# EAGLE design APRSTracker (EAGLE 7.6.0)
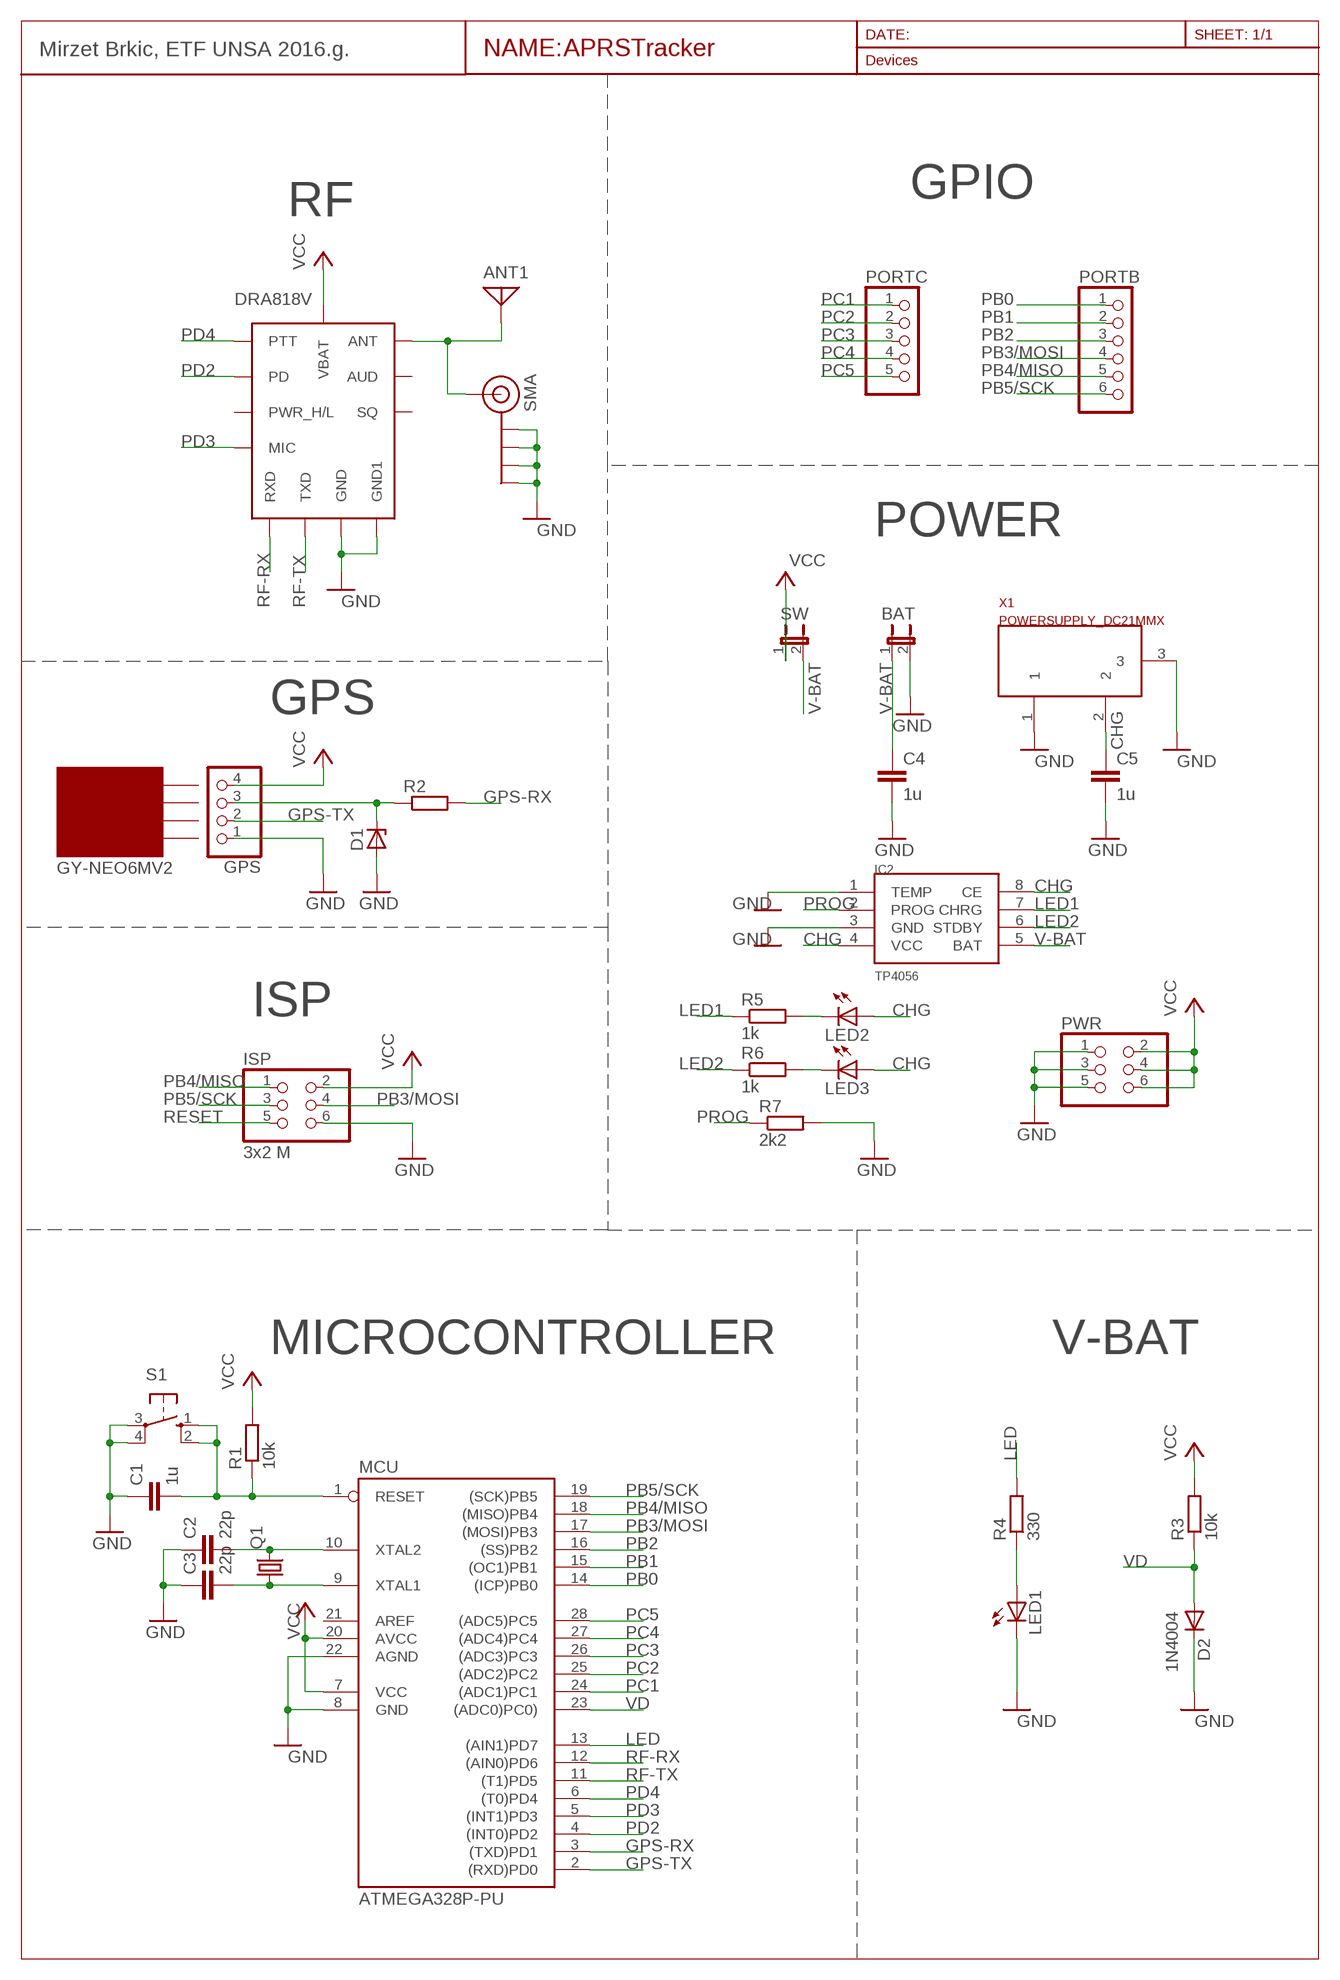
[diagram p0: schematic, sheet 1]

## Parts
ANT1  ANTENNA  [PAD-01]
BAT  JP1E  [JP1]
C1  1u  C-EU050-024X044  [C050-024X044]
C2  22p  C-EU025-024X044  [C025-024X044]
C3  22p  C-EU025-024X044  [C025-024X044]
C4  1u  C-EU050-024X044  [C050-024X044]
C5  1u  C-EU050-024X044  [C050-024X044]
D1  ZENER-DIODEDO35Z10  [DO35Z10]
D2  1N4004  [DO41-10]
DRA818V  DRA818V  [DRA8XXZ]
GPS  PINHD-1X4  [1X04]
IC2  TP4056  [SOP-8]
ISP  3x2 M  PINHD-2X3  [2X03]
LED1  LED3MM  [LED3MM]
LED2  LED3MM  [LED3MM]
LED3  LED3MM  [LED3MM]
MCU  ATMEGA328P-PU  [DIL28-3]
PORTB  PINHD-1X6  [1X06]
PORTC  PINHD-1X5  [1X05]
PWR  PINHD-2X3  [2X03]
Q1  CRYSTALHC49S  [HC49/S]
R1  10k  R-EU_0207/10  [0207/10]
R2  R-EU_0207/10  [0207/10]
R3  10k  R-EU_0207/10  [0207/10]
R4  330  R-EU_0207/10  [0207/10]
R5  1k  R-EU_0207/10  [0207/10]
R6  1k  R-EU_0207/10  [0207/10]
R7  2k2  R-EU_0207/10  [0207/10]
S1  10-XX  [B3F-10XX]
SMA  SMA_EDGE  [SMA-EDGE]
SW  JP1E  [JP1]
X1  POWERSUPPLY_DC21MMX  [POWERSUPPLY_DC-21MM]

## Nets
CHG: C5.1 IC2.4(VCC) IC2.8(CE) LED2.A LED3.A X1.2
GND [gnd]: BAT.2 C1.1 C2.1 C3.1 C4.2 C5.2 D1.A D2.C DRA818V.P$9(GND) DRA818V.P$10(GND1) GPS.1 IC2.1(TEMP) IC2.3(GND) ISP.6 LED1.K(C) MCU.8(GND) MCU.22(AGND) PWR.1 PWR.3 PWR.5 R7.2 S1.3(P) S1.4(P1) SMA.GND@0(GND) SMA.GND@1(GND) SMA.GND@2(GND) SMA.GND@3(GND) X1.1 X1.3
GPS-RX: MCU.3((TXD)PD1) R2.2
GPS-TX: GPS.2 MCU.2((RXD)PD0)
LED: MCU.13((AIN1)PD7) R4.2
LED1: IC2.7(CHRG) R5.1
LED2: IC2.6(STDBY) R6.1
N$1: ANT1.1 DRA818V.P$12(ANT) SMA.SIG(SIGNAL)
N$2: D1.C GPS.3 R2.1
N$3: LED1.A R4.1
N$4: LED2.K(C) R5.2
N$5: C3.2 MCU.9(XTAL1) Q1.1
N$6: C2.2 MCU.10(XTAL2) Q1.2
N$7: LED3.K(C) R6.2
PB0: MCU.14((ICP)PB0) PORTB.1
PB1: MCU.15((OC1)PB1) PORTB.2
PB2: MCU.16((SS)PB2) PORTB.3
PB3/MOSI: ISP.4 MCU.17((MOSI)PB3) PORTB.4
PB4/MISO: ISP.1 MCU.18((MISO)PB4) PORTB.5
PB5/SCK: ISP.3 MCU.19((SCK)PB5) PORTB.6
PC1: MCU.24((ADC1)PC1) PORTC.1
PC2: MCU.25((ADC2)PC2) PORTC.2
PC3: MCU.26((ADC3)PC3) PORTC.3
PC4: MCU.27((ADC4)PC4) PORTC.4
PC5: MCU.28((ADC5)PC5) PORTC.5
PD2: DRA818V.P$6(PD) MCU.4((INT0)PD2)
PD3: DRA818V.P$18(MIC) MCU.5((INT1)PD3)
PD4: DRA818V.P$5(PTT) MCU.6((T0)PD4)
PROG: IC2.2(PROG) R7.1
RESET: C1.2 ISP.5 MCU.1(RESET) R1.1 S1.1(S) S1.2(S1)
RF-RX: DRA818V.P$16(RXD) MCU.12((AIN0)PD6)
RF-TX: DRA818V.P$17(TXD) MCU.11((T1)PD5)
V-BAT: BAT.1 C4.1 IC2.5(BAT) SW.2
VCC: DRA818V.P$8(VBAT) GPS.4 ISP.2 MCU.7(VCC) MCU.20(AVCC) PWR.2 PWR.4 PWR.6 R1.2 R3.2 SW.1
VD: D2.A MCU.23((ADC0)PC0)) R3.1
Unconnected: DRA818V.P$1(SQ) DRA818V.P$3(AUD) DRA818V.P$7(PWR_H/L) MCU.21(AREF)

## Notes on the sheet
- Mirzet Brkic, ETF UNSA 2016.g.
- GPIO
- RF
- SMA
- POWER
- GPS
- GY-NEO6MV2
- ISP
- MICROCONTROLLER | V-BAT

## Library data of the parts
ANT1 = discrete:ANTENNA: Antenna
BAT SW = jumper:JP1E: JUMPER
C1-C5 = rcl:C-EU: CAPACITOR, European symbol
D1 = diode:ZENER-DIODE: Z-Diode
D2 = diode1:1N4004: DIODE general purpose rectifier, 1 A
DRA818V = dra818V:DRA818V: VHF FM module
GPS = pinhead:PINHD-1X4: PIN HEADER
IC2 = TP4056:TP4056
ISP = SmartPrj:PINHD-2X3: PIN HEADER
LED1-LED3 = led:LED: LED OSRAM: - CHIPLED LG R971, LG N971, LY N971, LG Q971, LY Q971, LO R971, LY R971 LH N974, LH R974 LS Q976, LO Q976, LY Q976 LO Q996 - Hyper CHIPLED LW Q18S LB Q993, LB Q99A, LB R99A - SideLED LS A670, LO A670, LY A670, LG A670, LP A670 LB A673, LV A673, LT A673, LW A673 LH A674 LY A675 LS A676, LA A676, LO A676, LY A676, LW A676 LS A679, LY A679, LG A679 - Hyper Micro SIDELED® LS Y876, LA Y876, LO Y876, LY Y876 LT Y87S - SmartLED LW L88C, LW L88S LB L89C, LB L89S, LG L890 LS L89K, LO L89K, LY L89K LS L896, LA L896, LO L896, LY L896 - TOPLED LS T670, LO T670, LY T670, LG T670, LP T670 LSG T670, LSP T670, LSY T670, LOP T670, LYG T670 LG T671, LOG T671, LSG T671 LB T673, LV T673, LT T673, LW T673 LH T674 LS T676, LA T676, LO T676, LY T676, LB T676, LH T676, LSB T676, LW T676 LB T67C, LV T67C, LT T67C, LS T67K, LO T67K, LY T67K, LW E67C LS E67B, LA E67B, LO E67B, LY E67B, LB E67C, LV E67C, LT E67C LW T67C LS T679, LY T679, LG T679 LS T770, LO T770, LY T770, LG T770, LP T770 LB T773, LV T773, LT T773, LW T773 LH T774 LS E675, LA E675, LY E675, LS T675 LS T776, LA T776, LO T776, LY T776, LB T776 LHGB T686 LT T68C, LB T68C - Hyper Mini TOPLED® LB M676 - Mini TOPLED Santana® LG M470 LS M47K, LO M47K, LY M47K Source: http://www.osram.convergy.de LUXEON: - LUMILED® LXK2-PW12-R00, LXK2-PW12-S00, LXK2-PW14-U00, LXK2-PW14-V00 LXK2-PM12-R00, LXK2-PM12-S00, LXK2-PM14-U00 LXK2-PE12-Q00, LXK2-PE12-R00, LXK2-PE12-S00, LXK2-PE14-T00, LXK2-PE14-U00 LXK2-PB12-K00, LXK2-PB12-L00, LXK2-PB12-M00, LXK2-PB14-N00, LXK2-PB14-P00, LXK2-PB14-Q00 LXK2-PR12-L00, LXK2-PR12-M00, LXK2-PR14-Q00, LXK2-PR14-R00 LXK2-PD12-Q00, LXK2-PD12-R00, LXK2-PD12-S00 LXK2-PH12-R00, LXK2-PH12-S00 LXK2-PL12-P00, LXK2-PL12-Q00, LXK2-PL12-R00 Source: www.luxeon.com KINGBRIGHT: KA-3528ASYC Source: www.kingbright.com
MCU = SmartPrj:ATMEGA328P-: MICROCONTROLLER 4 Kbytes FLASH 128 bytes SRAM 256 bytes EEPROM UART 6-channel 10 bit ADC
PORTB = pinhead:PINHD-1X6: PIN HEADER
PORTC = pinhead:PINHD-1X5: PIN HEADER
PWR = pinhead:PINHD-2X3: PIN HEADER
Q1 = crystal:CRYSTAL: CRYSTAL; OC_FARNELL: 1667008; OC_NEWARK: unknown
R1-R7 = rcl:R-EU_: RESISTOR, European symbol
S1 = switch-omron:10-XX: OMRON SWITCH; MPN: B3F-1000; OC_FARNELL: 176432; OC_NEWARK: 36M3542
SMA = SparkFun:SMA_EDGE: SMA Antenna Connector End launch SMA connector. The paste layer has been removed so that the connector can be hand soldered onto the board after reflow.
X1 = SmartPrj:POWERSUPPLY_DC21MM

## Net classes
1 power: width 0.61 mm, drill 0.61 mm, clearance 0.254 mm
2 gnd: width 0.305 mm, drill 0.559 mm, clearance 0.254 mm
3 usbvcc: width 0.508 mm, drill 0.61 mm, clearance 0.254 mm

## Board
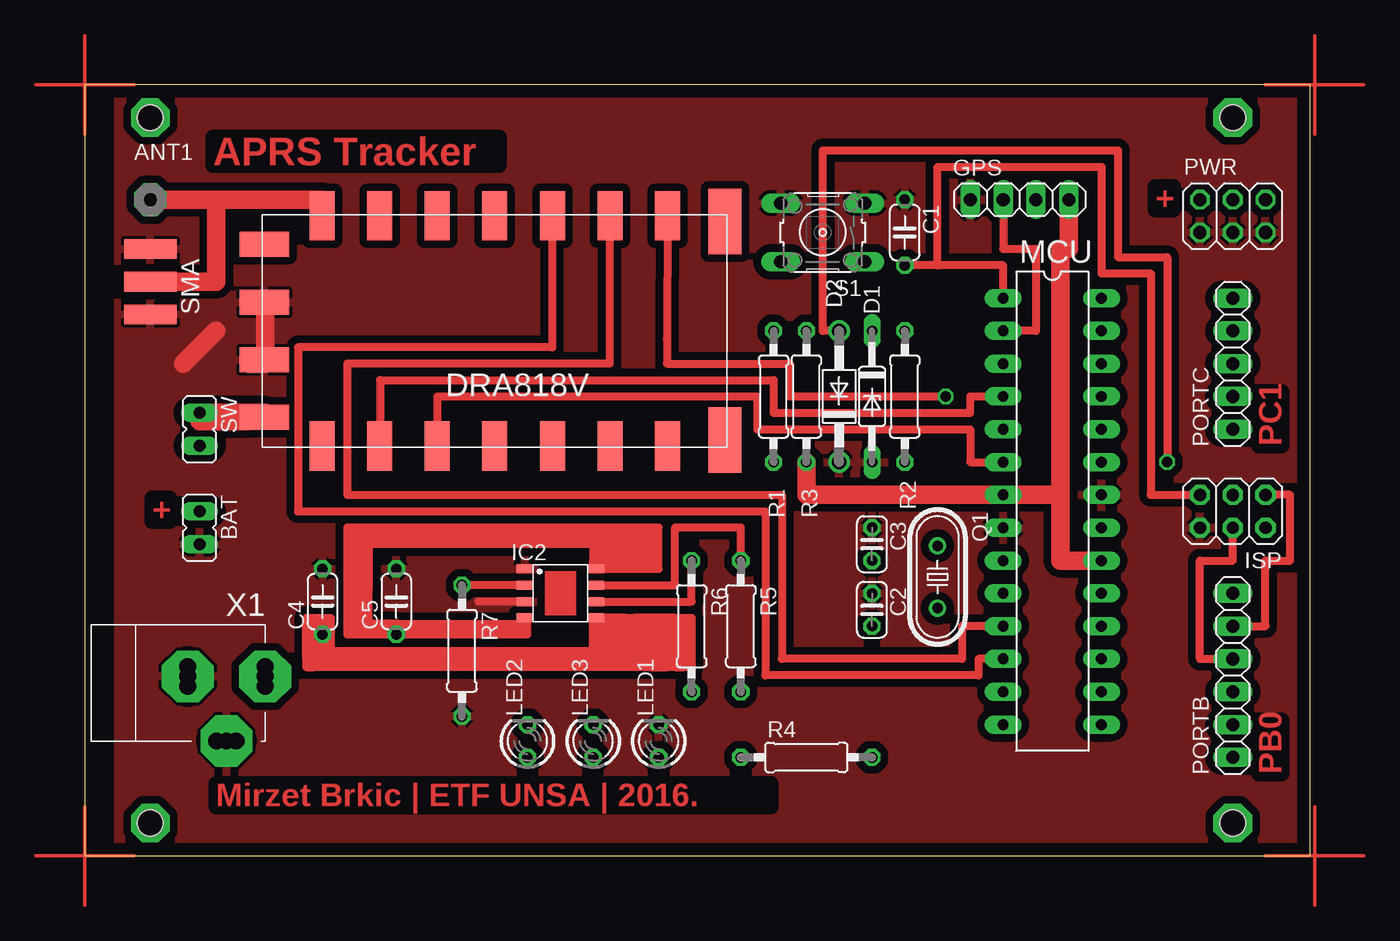
[diagram p1: board, top side]
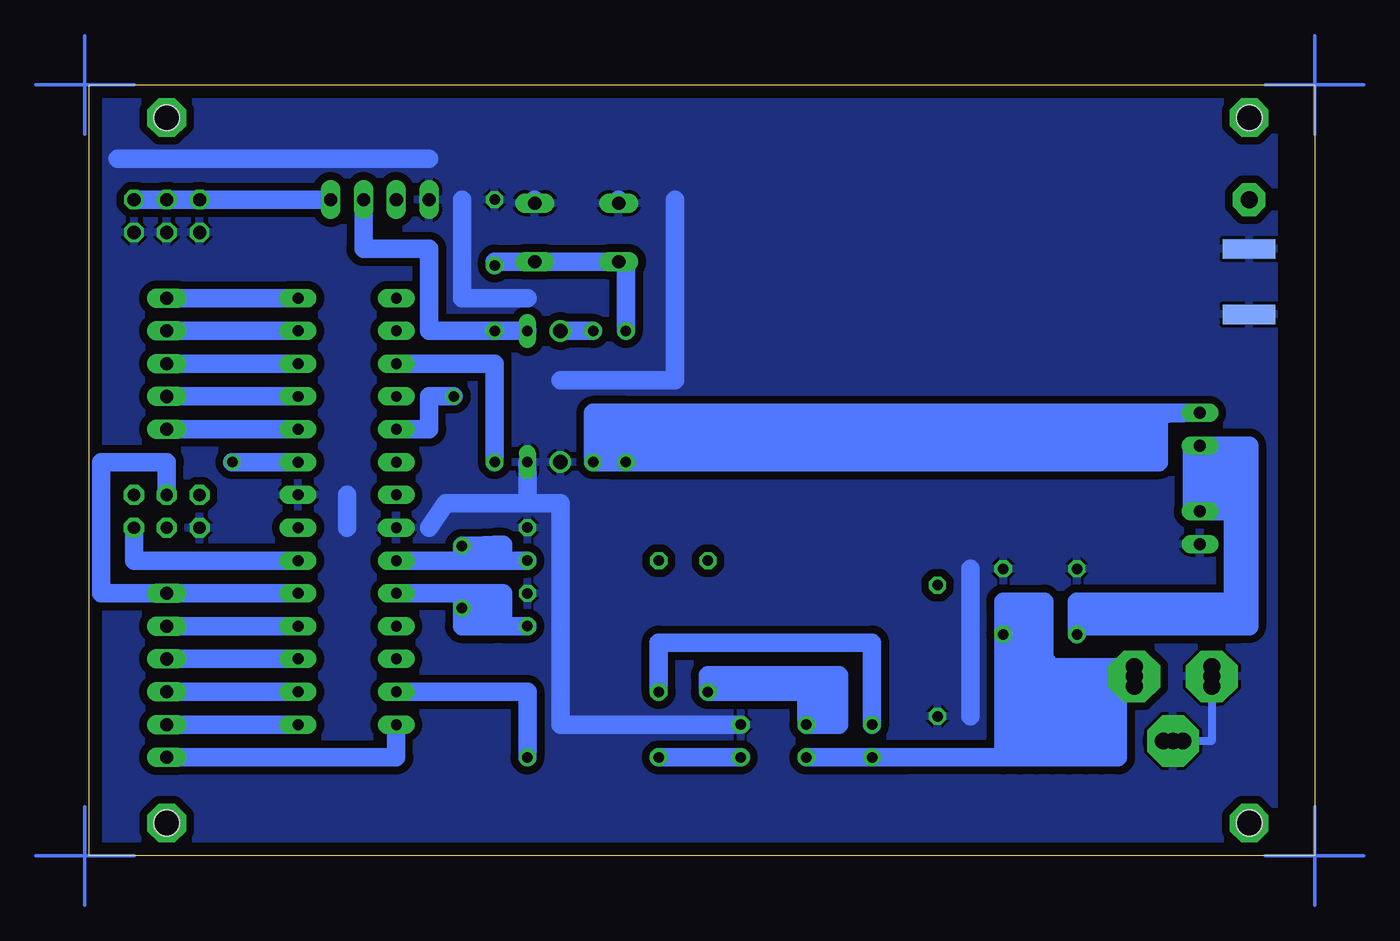
[diagram p2: board, bottom side, seen from below]

Size 94.92 x 59.68 mm. Coordinates in mm from the lower left corner, seen from the top.
Outline: 0,0 94.92,0 94.92,59.68 0,59.68 0,0
Copper layers (1*16): Top 0.035mm / dielectric 1.5mm / Bottom 0.035mm
Design rules "default": minimum track width 10mil, minimum drill 24mil, track to track 8mil, track to pad 8mil, pad to pad 8mil, via to via 8mil, smd to smd 8mil, copper to edge 40mil, drill to drill 8mil, minimum pad ring 10mil, minimum via ring 8mil, stop-mask expansion 4mil, vias tented up to drill 0mil, thermal gap 10mil
Holes 2 mm at 5.08,57.15 88.9,57.15 88.9,2.54 5.08,2.54

### Footprints (pad centres in the part's own frame; a part is rotated, then mirrored left to right if it is on the bottom)
PAD-01 = drill 1.321 pad 2.54 octagon: 1 0,0
JP1 = drill 0.914 long: 1 0,-1.27; 2 0,1.27
C050-024X044 = drill 0.813 octagon: 1 -2.54,0; 2 2.54,0
C025-024X044 = drill 0.813 octagon: 1 -1.27,0; 2 1.27,0
DO35Z10 = drill 0.813 long: A 5.08,0; C -5.08,0
DO41-10 = drill 1.118: A 5.08,0; C -5.08,0
DRA8XXZ = smd 1.93 x 3.81: P$1 -13.38,8.92; P$2 -8.92,8.92; P$3 -4.46,8.92; P$4 0,8.92; P$5 4.46,8.92; P$6 8.92,8.92; P$7 13.38,8.92; P$12 13.38,-8.92; P$13 8.92,-8.92; P$14 4.46,-8.92; P$15 0,-8.92; P$16 -4.46,-8.92; P$17 -8.92,-8.92; P$18 -13.38,-8.92 | smd 3.81 x 1.93: P$8 17.84,6.69; P$9 17.84,2.23; P$10 17.84,-2.23; P$11 17.84,-6.69 | smd 2.54 x 5.08: P$19 -17.84,-8.46; P$20 -17.84,8.46
1X04 = drill 1.016 long: 1 -3.81,0; 2 -1.27,0; 3 1.27,0; 4 3.81,0
SOP-8 = smd 1.3 x 0.7: 1 -2.75,1.905; 2 -2.75,0.635; 3 -2.75,-0.635; 4 -2.75,-1.905; 5 2.75,-1.905; 6 2.75,-0.635; 7 2.75,0.635; 8 2.75,1.905
2X03 = drill 0.95 pad 1.55 octagon: 1 -2.54,-1.27; 2 -2.54,1.27; 3 0,-1.27; 4 0,1.27; 5 2.54,-1.27; 6 2.54,1.27
LED3MM = drill 0.813 octagon: A -1.27,0; K 1.27,0
DIL28-3 = drill 0.85 pad 1.422 long: 1 -16.51,-3.81; 2 -13.97,-3.81; 3 -11.43,-3.81; 4 -8.89,-3.81; 5 -6.35,-3.81; 6 -3.81,-3.81; 7 -1.27,-3.81; 8 1.27,-3.81; 9 3.81,-3.81; 10 6.35,-3.81; 11 8.89,-3.81; 12 11.43,-3.81; 13 13.97,-3.81; 14 16.51,-3.81; 15 16.51,3.81; 16 13.97,3.81; 17 11.43,3.81; 18 8.89,3.81; 19 6.35,3.81; 20 3.81,3.81; 21 1.27,3.81; 22 -1.27,3.81; 23 -3.81,3.81; 24 -6.35,3.81; 25 -8.89,3.81; 26 -11.43,3.81; 27 -13.97,3.81; 28 -16.51,3.81
1X06 = drill 1.016 long: 1 -6.35,0; 2 -3.81,0; 3 -1.27,0; 4 1.27,0; 5 3.81,0; 6 6.35,0
1X05 = drill 1.016 long: 1 -5.08,0; 2 -2.54,0; 3 0,0; 4 2.54,0; 5 5.08,0
2X03' = drill 1.016 octagon: 1 -2.54,-1.27; 2 -2.54,1.27; 3 0,-1.27; 4 0,1.27; 5 2.54,-1.27; 6 2.54,1.27
HC49/S = drill 0.813: 1 -2.413,0; 2 2.413,0
0207/10 = drill 0.813 octagon: 1 -5.08,0; 2 5.08,0
B3F-10XX = drill 1.016 long: 1 -3.251,2.261; 2 3.251,2.261; 3 -3.251,-2.261; 4 3.251,-2.261
SMA-EDGE = smd 1.524 x 4.064: GND@0 0,0; GND@1 5.08,0; SIG 2.54,0 | smd 1.524 x 4.064 bottom: GND@2 0,0; GND@3 5.08,0
POWERSUPPLY_DC-21MM = drill 1.3 pad 4 octagon: 1 -5.08,-3.353; 2 -0.076,-6.35; 3 -0.076,-0.356 | drill 1.3: 4 -5.08,-4.115; 5 -5.08,-2.591; 6 -0.838,-0.356; 7 0.686,-0.356; 8 -0.838,-6.35; 9 0.686,-6.35

### Placement (x,y rotation side)
ANT1  5.08,50.8 0 top
BAT  8.89,25.4 180 top
C1  63.5,48.26 270 top
C2  60.96,19.05 270 top
C3  60.96,24.13 270 top
C4  18.41,19.69 90 top
C5  24.13,19.69 90 top
D1  60.96,35.56 270 top
D2  58.42,35.56 90 top
DRA818V  31.75,40.64 180 top
GPS  72.39,50.8 0 top
IC2  36.83,20.32 0 top
ISP  88.9,26.67 180 top
LED1  44.45,8.89 90 top
LED2  34.29,8.89 90 top
LED3  39.37,8.89 90 top
MCU  74.93,26.67 270 top
PORTB  88.9,13.97 90 top
PORTC  88.9,38.1 90 top
PWR  [2X03']  88.9,49.53 0 top
Q1  66.04,21.59 270 top
R1  53.34,35.56 270 top
R2  63.5,35.56 270 top
R3  55.88,35.56 270 top
R4  55.88,7.62 0 top
R5  50.8,17.78 270 top
R6  46.99,17.78 270 top
R7  29.21,15.88 270 top
S1  57.15,48.26 180 top
SMA  5.08,41.91 90 top
SW  8.89,33.02 180 top
X1  7.62,13.97 90 top

### Tracks (layer width: path | path; a pad name or v marks a point on that pad's centre or on a via)
CHG
  Top 0.61: C5.1 24.15,17.57 | IC2.8 40,22.23 | 40,22.23 44.45,22.23 44.45,25.4 20.32,25.4 20.32,17.15 34.29,17.15 34.29,17.78 | 34.29,17.78 34.29,18.41 IC2.4 | 33.62,17.54 34.29,17.78 | 40.64,24.13 39.37,24.77 | 39.37,22.23 39.37,22.86 | 40,22.23 40,22.86 39.37,22.86 | 40,23.5 39.37,24.77 | 39.37,24.13 39.37,22.86 | 39.37,24.77 39.37,24.13 | 39.37,24.13 21.59,24.13
  Top 1.27: 40,23.5 40,22.86 40.64,22.86
  Top 1.422: 33.62,17.54 24.15,17.57 21.57,17.57 | 21.57,17.57 20.95,17.78 20.95,23.5 | 20.95,23.5 20.95,24.13 | 20.95,24.13 20.95,24.77 39.37,24.77 | 39.37,24.77 43.81,24.77 43.81,24.13 | 43.81,23.5 43.81,22.86 40.64,22.86 | 40.64,24.13 40.64,23.5 43.81,23.5 | 43.81,23.5 43.81,24.13 | 43.81,24.13 39.37,24.77 | 20.95,24.13 21.59,24.13 21.59,23.5 | 20.95,23.5 21.59,23.5 | 21.59,23.5 21.57,17.57
  Bottom 1.422: LED3.A LED2.A | LED2.A 31.75,7.62 | 16.51,7.62 15.24,7.62 15.24,13.89 X1.2 13.97,13.34 14.61,13.34 14.61,14.61 | 16.51,7.62 17.78,7.62 | 20.32,7.62 21.59,7.62 | 22.86,7.62 24.13,7.62 | 24.13,7.62 LED2.A | 20.95,15.24 20.95,19.69 24.13,19.69 24.13,19.05 | 24.13,19.05 C5.1 | C5.1 24.13,8.89 | 24.13,7.62 24.13,8.89 | 24.13,8.89 22.86,8.89 | 22.86,8.89 22.86,13.97 | 22.86,17.15 22.86,19.05 | 22.86,19.05 24.13,19.05 | 22.86,19.05 21.59,19.05 21.59,7.62 | 21.59,7.62 22.86,7.62 | 22.86,7.62 22.86,8.89 | 22.86,13.97 20.32,13.97 | 20.32,13.97 20.32,8.89 | 20.32,7.62 20.32,8.89 | 20.32,8.89 19.05,8.89 | 19.05,8.89 19.05,13.97 | 19.05,13.97 20.32,13.97 | 19.05,13.97 17.78,13.97 | 17.78,13.97 17.78,7.62 | 17.78,7.62 19.05,7.62 | 19.05,7.62 19.05,8.89 | 19.05,8.89 16.51,8.89 | 16.51,8.89 16.51,12.7 | 16.51,8.89 16.51,7.62 | 19.05,7.62 20.32,7.62 | 22.86,13.97 22.86,17.15 | 22.86,17.15 C5.1 | 20.95,14.61 20.95,15.24 | 20.95,15.24 20.32,14.61 | 13.97,13.97 13.97,14.61 15.24,14.61 | 15.24,13.97 17.78,13.97 | 17.78,13.97 20.32,14.61 | 20.32,14.61 16.51,14.61 | 13.97,13.97 13.97,12.7 16.51,12.7 | 16.51,12.7 16.51,14.61 | 16.51,14.61 15.24,14.61 | 15.24,14.61 15.24,13.97 | 15.24,13.97 13.97,13.97
GND
  Top 0.61: 13.6,38.1 DRA818V.P$9 13.97,38.41 13.97,38.1 | 34.29,22.23 IC2.1 | IC2.3 30.48,19.69
  Top 1.422: 13.6,38.1 12.7,38.1 | 13.97,38.1 13.97,42.87 | 7.62,38.1 10.16,40.64
  Bottom 0.61: X1.3 7.98,8.89 X1.1
  Bottom 1.422: 74.93,25.4 74.93,27.94 | 66.04,50.8 66.04,43.18 60.96,43.18 | 49.53,50.8 49.53,36.83 58.42,36.83 | 26.67,22.23 26.67,10.8 | 60.96,27.3 67.31,27.3 68.58,25.4 | 60.96,27.3 58.42,27.3 58.42,10.16 LED1.K | 92.71,53.98 68.58,53.98 | D1.A 60.96,27.3 | 60.4,50.8 S1.3 | 53.9,50.8 S1.4
  pour Bottom (isolate 0.61): 3.17,59.69 3.17,0 96.52,0 96.52,59.69
  pour Top (isolate 0.61): 2.54,59.69 2.54,0 95.25,0 95.25,59.69
GPS-RX
  Bottom 1.422: MCU.3 63.5,38.1 R2.2
GPS-TX
  Top 0.61: GPS.2 71.12,46.99 73.66,46.99 73.66,40.64 MCU.2
LED
  Bottom 1.422: MCU.13 60.96,12.7 R4.2
LED1
  Top 0.61: IC2.7 45.72,20.95 45.72,25.4 50.8,25.4 R5.1
LED2
  Top 0.61: IC2.6 46.99,19.69 R6.1
N$1
  Top 1.422: DRA818V.P$12 18.41,50.8 10.16,50.8 | 10.16,50.8 10.16,44.45 SMA.SIG | 10.16,50.8 ANT1.1
N$2
  Bottom 1.422: GPS.3 73.66,46.99 68.58,46.99 68.58,40.64 R2.1 D1.C
N$3
  Bottom 1.422: R4.1 LED1.A
N$4
  Bottom 1.422: R5.2 50.8,16.51 34.29,16.51 LED2.K
N$5
  Bottom 1.422: 62.88,24.08 Q1.1 66.04,22.86 | 62.86,22.86 62.86,24.08 62.88,24.08 | 62.86,22.86 63.5,22.86 | 63.5,22.86 66.04,22.86 | 66.04,22.86 MCU.9 | 62.88,24.08 63.5,24.08 63.5,22.86 | 62.86,22.86 C3.2
N$6
  Bottom 1.422: 65.41,20.32 Q1.2 | Q1.2 63.5,17.84 | 63.5,17.84 C2.2 | 62.86,19.11 62.86,20.32 63.5,20.32 | 62.86,19.11 63.5,17.84 | Q1.2 66.04,17.78 63.5,17.78 | 62.86,17.78 C2.2 | 66.04,20.32 Q1.2 | 66.04,20.32 MCU.10 | 66.04,20.32 64.77,20.32 | 62.86,19.11 62.86,17.78 | 62.86,17.78 63.5,17.78 | 63.5,19.05 63.5,20.32 | 63.5,20.32 64.77,20.32 | 64.77,20.32 64.77,19.05 63.5,19.05 | 63.5,19.05 63.5,17.78 | 62.86,17.78 C2.2
N$7
  Bottom 1.422: 39.37,12.7 39.37,11.43 | 39.37,11.43 LED3.K 36.83,10.16 36.83,11.43 | 36.83,12.7 36.83,13.97 38.1,13.97 | 38.1,13.97 46.99,13.97 R6.2 | R6.2 39.37,12.7 | 39.37,12.7 36.83,12.7 | 36.83,12.7 36.83,11.43 | 36.83,11.43 38.1,11.43 | 39.37,11.43 38.1,11.43 | 38.1,11.43 38.1,12.7 | 38.1,13.97 38.1,12.7 | 38.1,12.7 R6.2
N$8  (via drill 2)
  other vias: 5.08,57.15
N$9  (via drill 2)
  other vias: 5.08,2.54
N$10  (via drill 2)
  other vias: 88.9,2.54
N$11  (via drill 2)
  other vias: 88.9,57.15
N$12
  Bottom 0.254: 0,63.5 0,55.88
N$13
  Bottom 0.254: 3.81,59.69 -3.81,59.69
N$14
  Bottom 0.254: 95.25,55.88 95.25,63.5
N$15
  Bottom 0.254: 91.44,59.69 99.06,59.69
N$16
  Bottom 0.254: 3.81,0 -3.81,0
N$17
  Bottom 0.254: 0,3.81 0,-2.54 0,-3.81
N$18
  Bottom 0.254: 95.25,3.81 95.25,-3.81
N$19
  Bottom 0.254: 91.44,0 99.06,0
N$20
  Top 0.254: 0,63.5 0,55.88
N$21
  Top 0.254: -3.81,59.69 3.81,59.69
N$22
  Top 0.254: 0,3.81 0,-3.81
N$23
  Top 0.254: -3.81,0 3.81,0
N$24
  Top 0.254: 91.44,0 99.06,0
N$25
  Top 0.254: 95.25,3.81 95.25,-3.81
N$26
  Top 0.254: 95.25,63.5 95.25,55.88
N$27
  Top 0.254: 91.44,59.69 99.06,59.69
PB0
  Bottom 1.422: PORTB.1 71.12,7.62 MCU.14
PB1
  Bottom 1.422: PORTB.2 MCU.15
PB2
  Bottom 1.422: PORTB.3 MCU.16
PB3/MOSI
  Top 0.61: PORTB.4 86.36,15.24 86.36,22.86 88.9,22.86 ISP.4
  Bottom 1.422: PORTB.4 MCU.17
PB4/MISO
  Top 0.61: ISP.1 93.34,27.94 93.34,22.86 91.44,22.86 91.44,17.78 PORTB.5
  Bottom 1.422: PORTB.5 MCU.18
PB5/SCK
  Bottom 1.422: MCU.19 PORTB.6 93.98,20.32 93.98,30.48 88.9,30.48 ISP.3
PC1
  Bottom 1.422: PORTC.1 MCU.24
PC2
  Bottom 1.422: PORTC.2 MCU.25
PC3
  Bottom 1.422: PORTC.3 MCU.26
PC4
  Bottom 1.422: PORTC.4 MCU.27
PC5
  Bottom 1.422: PORTC.5 MCU.28
PD2
  Top 0.61: DRA818V.P$6 22.83,31.75 22.86,31.75 22.86,36.83 53.34,36.83 53.34,34.29 68.58,34.29 68.58,35.56 MCU.4
PD3  (via drill 0.8 pad 1.02)
  Top 0.61: DRA818V.P$18 45.09,40.01 45.09,38.1 54.61,38.1 54.61,35.56 v66.67,35.56
  Bottom 1.422: MCU.5 68.58,33.02 68.58,35.56 v66.67,35.56
PD4
  Top 0.61: DRA818V.P$5 27.3,31.72 27.3,35.56 52.07,35.56 52.07,33.02 68.58,33.02 68.58,30.48 MCU.6
PROG
  Top 0.61: IC2.2 R7.1
RESET
  Top 0.61: 66.04,45.72 C1.2 | MCU.1 71.12,45.72 66.04,45.72 | 66.04,45.72 66.04,53.34 78.74,53.34 78.74,45.09 82.55,45.09 82.55,27.94 ISP.5
  Bottom 1.422: C1.2 63.5,46 S1.1 S1.2 53.34,46 R1.1
RF-RX
  Top 0.61: 36.2,49.53 36.2,48.9 36.2,39.37 16.51,39.37 16.51,26.67 52.7,26.67 52.7,13.97 69.22,13.97 69.22,15.24 MCU.12
  Top 1.016: DRA818V.P$16 36.2,48.9
RF-TX
  Top 0.61: 40.64,49.53 40.64,38.1 20.32,38.1 20.32,27.94 53.98,27.94 53.98,15.24 67.95,15.24 67.95,17.78 MCU.11
  Top 1.016: DRA818V.P$17 40.64,49.53
V-BAT
  Top 0.61: 41.91,18.41 42.55,18.41 | 43.18,14.61 20.32,14.61 | 20.32,14.61 20.32,15.24 | 20.32,15.24 20.95,15.24 | 43.81,14.61 44.45,14.61 | 45.72,14.61 46.35,14.61 | 44.45,18.41 43.81,18.41 | 43.81,18.41 43.18,18.41 | 43.81,15.24 43.18,15.24 | 43.18,17.78 43.81,17.78 | 43.81,17.78 43.81,18.41 | 43.81,17.15 43.81,14.61 | 43.81,14.61 43.18,14.61 | 43.18,17.15 43.18,15.24 | 43.18,14.61 43.18,15.24 | 43.18,15.24 41.27,15.24 | 41.27,15.24 40.64,17.78 41.27,17.78 | 41.27,17.78 41.91,17.78 | 41.91,17.78 41.91,18.41 | 41.91,18.41 40.64,18.41 | 40.64,18.41 IC2.5 | IC2.5 39.37,18.41 39.37,15.88 19.05,15.88 | 46.99,17.15 46.99,16.51 | 46.99,15.88 46.99,14.61 46.35,14.61 | 46.35,14.61 46.35,15.24 46.35,16.51 | 45.09,17.15 46.35,17.78 46.99,17.78 | 45.09,17.15 45.72,18.41 | 45.09,18.41 44.45,18.41 | 44.45,18.41 44.45,17.15 | 44.45,17.15 44.45,14.61 | 44.45,14.61 45.09,14.61 | 45.72,17.78 45.72,17.15 | 45.72,17.15 45.72,14.61 | 45.72,14.61 45.09,14.61 | 45.09,14.61 45.09,15.88 | 45.09,15.88 45.09,17.15 | 45.09,17.15 45.09,18.41 | 43.18,18.41 42.55,18.41 | 42.55,18.41 42.55,17.78 | 43.81,17.78 45.72,17.78 | 46.99,17.78 45.72,17.15 | 45.72,18.41 45.09,18.41 | 43.18,18.41 43.18,17.78 | 43.18,17.78 45.09,17.15 | 45.09,17.15 arc-23 45.72,17.15 | 46.99,17.78 46.99,17.15 | 46.99,17.15 45.72,17.15 | 45.72,17.15 45.09,17.15 | 45.09,17.15 44.45,17.15 | 44.45,17.15 43.81,17.15 | 41.91,17.78 41.91,17.15 41.91,16.51 | 41.91,17.78 42.55,17.78 | 42.55,17.78 42.55,17.15 | 43.18,17.15 42.55,17.15 | 41.91,16.51 46.35,16.51 | 46.35,16.51 46.99,16.51 | 46.99,16.51 46.99,15.88 | 46.99,15.88 45.09,15.88 | 45.09,15.88 42.55,15.88 | 41.91,15.88 41.27,15.88 | 41.27,15.88 41.27,15.24 | 41.27,15.88 41.91,16.51
  Top 0.61: 42.55,17.15 41.27,17.78 | 42.55,17.78 43.18,17.78 | 43.81,17.78 43.81,17.15 | 43.81,17.15 43.18,17.15 | 40.64,16.51 40.64,15.24 | 19.05,14.61 19.05,15.24 20.32,15.24 | 20.32,14.61 19.05,14.61 | 19.05,14.61 18.41,14.61 | 18.41,14.61 17.78,14.61 | 17.14,15.24 17.14,15.88 | 17.14,16.51 17.14,17.15 | 17.14,17.78 17.14,18.41 17.78,18.41 | 18.41,14.61 18.41,15.24 | 17.14,15.24 17.78,15.24 17.78,14.61 | 17.14,15.24 17.14,14.61 17.78,14.61 | 17.78,17.78 17.78,18.41 | 18.41,15.24 18.41,15.88 | 18.41,15.88 17.14,15.88 | 17.14,15.88 17.14,16.51 | 17.14,16.51 17.78,16.51 | 17.78,16.51 18.41,16.51 18.41,15.88 | C4.1 17.14,17.15 | 17.14,17.15 17.14,17.78 | 17.14,17.78 17.78,17.78 | 17.78,17.78 18.41,17.78 19.05,15.88 | 18.41,15.24 17.78,16.51 | 17.78,16.51 19.05,15.88 | 40.64,18.41 40,17.78 39.37,15.24 31.75,15.24 18.41,15.24 | 45.72,17.78 45.72,18.41 | 45.72,18.41 46.99,18.41 46.99,17.78 | 46.99,17.15 45.72,17.78 | 45.72,17.78 IC2.5 | 17.78,18.41 19.05,18.41 19.05,15.88
  Top 1.27: 42.55,17.15 42.55,16.51 | 42.55,16.51 46.35,16.51 46.35,17.78 45.72,17.78 43.18,17.78 43.18,17.15 44.45,17.15 44.45,15.24 | 44.45,15.24 46.35,15.24 | 44.45,15.24 41.27,15.24 40.64,15.24 40,15.24 | 20.95,15.24 19.05,15.24 | 40,15.24 41.91,15.88 | 41.91,15.88 41.91,16.51 | 42.55,17.15 40,15.24 | 41.91,15.88 42.55,15.88 42.55,16.51 | 41.91,17.15 42.55,17.15 | 42.55,17.15 40.64,17.78 | 42.55,17.15 41.91,16.51 | 41.91,16.51 40.64,16.51 | 17.78,16.51 19.05,15.24 | 19.05,15.24 18.41,15.24 17.78,15.24 17.78,16.51 | 17.78,16.51 17.78,17.78 | 18.41,16.51 C4.1 | C4.1 18.41,17.78 | C4.1 17.78,16.51
  Top 1.422: 17.78,15.24 31.75,15.24 40.64,15.24 40,16.51 40,17.78 41.91,16.51 45.09,15.88 45.72,17.78
  Bottom 1.422: BAT.1 6.35,26.67 6.35,19.69 | 6.35,19.05 6.35,19.69 | 6.35,19.69 17.14,19.69 | 17.14,19.69 18.41,19.69 18.41,17.78 | 17.14,17.78 5.71,17.78 | 5.71,17.78 5.71,19.05 17.14,19.05 | 6.35,19.69 5.71,19.69 5.71,31.75 9.53,31.75 9.53,31.12 | 9.53,26.67 9.53,31.12 | 9.53,31.12 6.35,31.12 6.35,27.3 6.99,27.3 6.99,30.48 7.62,30.48 7.62,27.3 8.25,27.3 8.25,27.94 8.89,27.94 SW.2 5.08,31.75 5.08,17.78 5.71,17.78 | 17.14,19.69 17.14,17.78 | 17.14,17.78 18.41,17.78 | 18.41,17.78 C4.1
VCC
  Top 1.422: DRA818V.P$8 13.97,34.29 SW.1 | R3.2 55.88,27.94 MCU.7 75.56,27.94 | SW.1 12.7,34.29 12.7,33.66 8.89,33.66 SW.1 | MCU.20 75.56,22.86 75.56,27.94 | GPS.4 76.2,46.99 75.56,46.99 75.56,27.94
  Bottom 1.422: PWR.4 PWR.6 PWR.2 GPS.4 | R1.2 52.07,30.48 | 52.07,30.48 15.88,30.48 | 15.88,30.48 13.97,30.48 | 13.97,30.48 13.97,31.75 | 13.97,33.02 13.97,34.29 | 13.97,34.29 12.7,34.29 | R1.2 53.34,31.75 | 53.34,31.75 53.34,34.29 | 53.34,34.29 13.97,34.29 | 12.7,34.29 SW.1 48.26,33.02 52.07,33.02 52.07,31.75 | 52.07,31.75 52.07,30.48 | 52.07,30.48 53.34,31.75 | 53.34,31.75 52.07,31.75 | 45.72,31.75 14.61,31.75 | 14.61,31.75 13.97,31.75 | 13.97,31.75 13.97,33.02 | 13.97,33.02 45.72,31.75 | 45.72,31.75 52.07,31.75 | 52.07,31.75 12.07,30.48 | 12.07,30.48 12.07,33.66 13.34,31.12 13.34,33.66 14.61,31.75 | 14.61,31.75 15.88,30.48 | 13.97,30.48 12.07,30.48 | 12.07,30.48 12.7,33.66 12.7,34.29 | 53.34,34.29 55.88,34.29 | 55.88,34.29 54.61,30.48 | 54.61,30.48 53.98,30.48 | 53.98,30.48 R1.2 | 52.07,30.48 53.98,33.66 53.98,30.48 | 53.98,30.48 52.07,33.66 54.61,33.02 55.88,34.29 | 55.88,34.29 R3.2 54.61,30.48 | MCU.20 91.44,22.86 ISP.2
VD  (via drill 0.8 pad 1.02)
  Top 0.61: v83.82,30.48 83.82,46.35 80.01,46.35 80.01,54.61 57.15,54.61 57.15,40.64 D2.A
  Bottom 1.422: MCU.23 v83.82,30.48 | R3.1 D2.A

### Text on the board
Top: APRS Tracker | + | PC1 | + | PB0 | Mirzet Brkic | ETF UNSA | 2016.
tNames: SMA